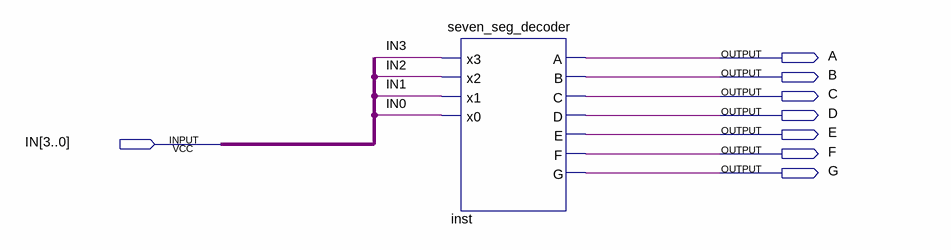
[diagram p0: schematic sheet]
// Quartus schematic bus_seven_seg_decoder.bdf as structural Verilog: 1 symbols, 8 pins
module bus_seven_seg_decoder (
  input  [3:0] IN,
  output A,
  output B,
  output C,
  output D,
  output E,
  output F,
  output G
);

  seven_seg_decoder inst (
    .x3(IN[3]), .x2(IN[2]), .x1(IN[1]), .x0(IN[0]), .A(A), .B(B), .C(C), .D(D), .E(E), .F(F), .G(G));
endmodule
